# Altium schematic sheet Motor_Control.SchDoc
size B
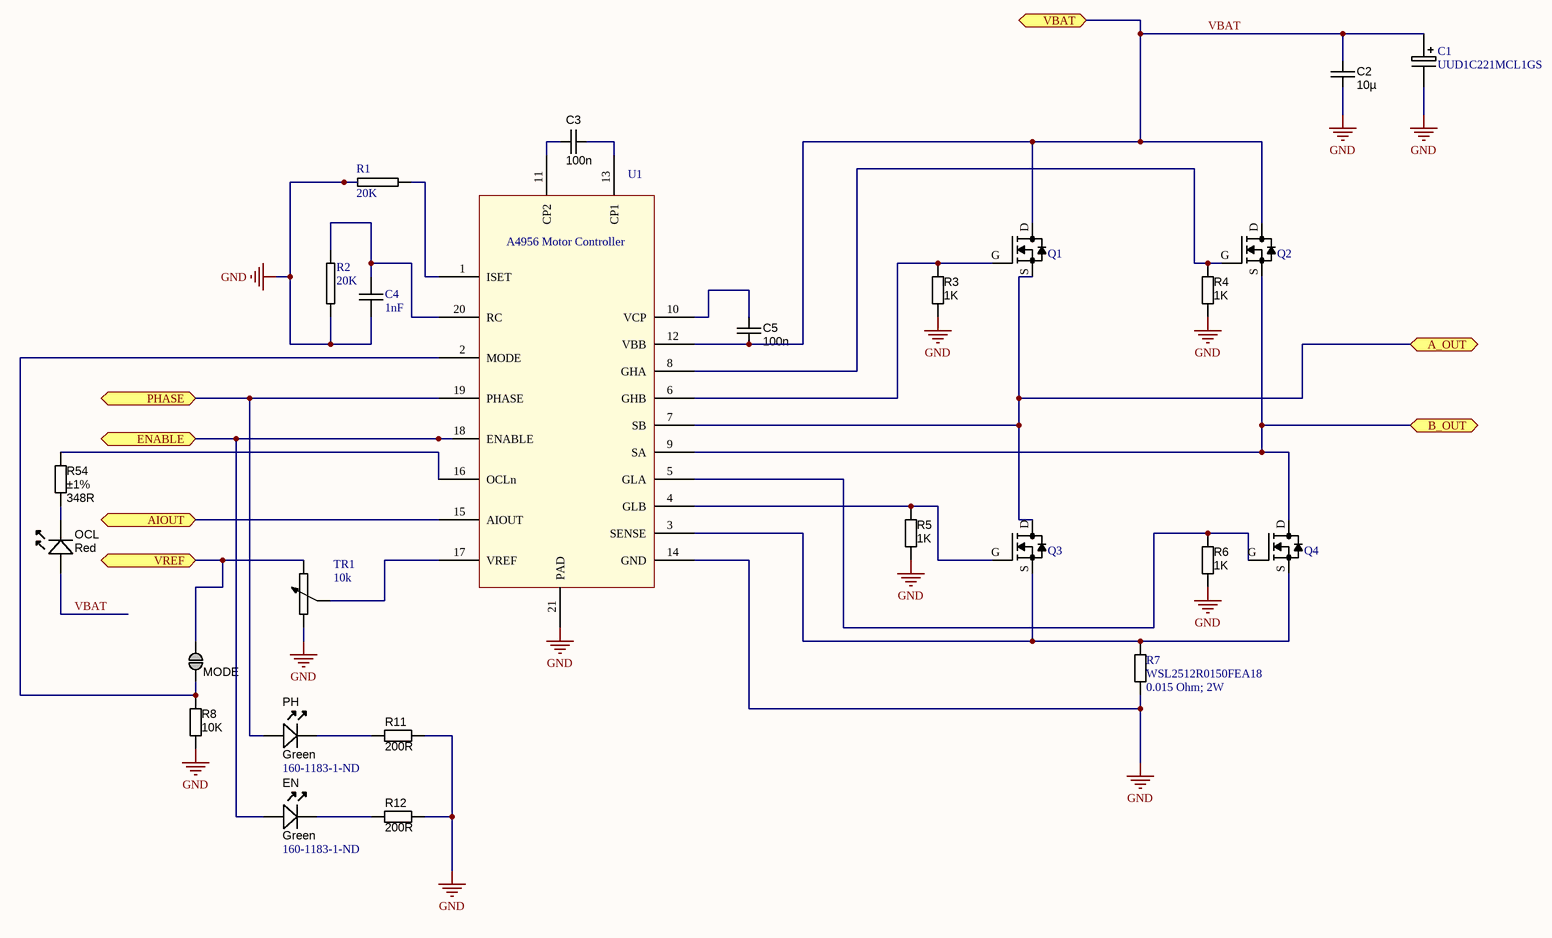
[diagram p0: Motor_Control.SchDoc]

## Parts
C1  UUD1C221MCL1GS  [NICH 6.3mm 7.7mm]
C2  value 10µ  [CAPC2012X135N]  (hidden comment: approved sub OK)
C3  value 100n  [CAPC1608X90N]  (hidden comment: approved sub OK)
C4  1nF  [0603C-GENERIC]
C5  value 100n  [CAPC1608X90N]  (hidden comment: approved sub OK)
EN  Green  Supplier Part Number 1: 160-1183-1-ND  [LED-0603-GREEN]
MODE  Jumper  [JUMP1]  (value not drawn)  (no BOM)
OCL  Red  [LED-0603-RED]
PH  Green  Supplier Part Number 1: 160-1183-1-ND  [LED-0603-GREEN]
Q1  SIS406DN  [1212-8 PowerPAK Single]  (value not drawn)
Q2  SIS406DN  [1212-8 PowerPAK Single]  (value not drawn)
Q3  SIS406DN  [1212-8 PowerPAK Single]  (value not drawn)
Q4  SIS406DN  [1212-8 PowerPAK Single]  (value not drawn)
R1  20K  [0603R-GENERIC]
R2  20K  [0603R-GENERIC]
R3  value 1K  [RESC1608X55N]  (hidden comment: Thick Film)
R4  value 1K  [RESC1608X55N]  (hidden comment: Thick Film)
R5  value 1K  [RESC1608X55N]  (hidden comment: Thick Film)
R6  value 1K  [RESC1608X55N]  (hidden comment: Thick Film)
R7  WSL2512R0150FEA18  Rating: 0.015 Ohm; 2W  [RESC_2512]
R8  value 10K  [RESC1608X55N]  (hidden comment: Thick Film)
R11  value 200R  [RESC1608X55N]  (hidden comment: Thick Film)
R12  value 200R  [RESC1608X55N]  (hidden comment: Thick Film)
R54  value 348R  Tolerance: ±1%  [RESC1608X55N]  (hidden comment: Thin Film)
TR1  10k  [TRIM3224]
U1  A4956  [QFN-20 - 8mil Pad Spacing]  (value not drawn)

## Ports
A_OUT, AIOUT, B_OUT, ENABLE, PHASE, VBAT, VREF

## Nets
GND: C1.- C2.2 C4.2 R1.1 R2.2 R3.2 R4.2 R5.2 R6.2 R7.2 R8.2 R11.2 R12.2 TR1.1 U1.14(GND) U1.21(PAD)
A_OUT: Q1.S Q3.D U1.7(SB) ; port A_OUT
AIOUT: U1.15(AIOUT) ; port AIOUT
B_OUT: Q2.S Q4.D U1.9(SA) ; port B_OUT
ENABLE: EN.A U1.18(ENABLE) ; port ENABLE
PHASE: PH.A U1.19(PHASE) ; port PHASE
VBAT: C1.+ C2.1 C5.2 OCL.A Q1.D Q2.D U1.12(VBB) ; port VBAT
VREF: MODE.2 TR1.2 ; port VREF
NetC3_1: C3.1 U1.11(CP2)
NetC3_2: C3.2 U1.13(CP1)
NetC4_1: C4.1 R2.1 U1.20(RC)
NetC5_1: C5.1 U1.10(VCP)
NetEN_K: EN.K R12.1
NetMODE_1: MODE.1 R8.1 U1.2(MODE)
NetOCL_K: OCL.K R54.2
NetPH_K: PH.K R11.1
NetQ1_G: Q1.G R3.1 U1.6(GHB)
NetQ2_G: Q2.G R4.1 U1.8(GHA)
NetQ3_G: Q3.G R5.1 U1.4(GLB)
NetQ3_S: Q3.S Q4.S R7.1 U1.3(SENSE)
NetQ4_G: Q4.G R6.1 U1.5(GLA)
NetR1_2: R1.2 U1.1(ISET)
NetR54_1: R54.1 U1.16(OCLn)
NetTR1_W: TR1.W U1.17(VREF)

## Notes on the sheet
- (in symbol Motor_CTRL_IC_A4956) A4956 Motor Controller

## Library data of the parts
C1 = NICHICON_220uF_16V: GENERIC CAPACITOR POLARISED; Supplier 1: Digi-Key; Supplier Part Number 1: 493-2264-1-ND
C2 = CAPC_10u_0805_16V: Capacitor SMD Cer 10uF 10% 16V X7R 0805; Ratings: 16V; X7R; Material: ceramic; SCDType: undef; Package / Case: 0805 (2012 metric); Tolerance: ±10%; Supplier 1: Digi-Key; Supplier Part Number 1: 709-1229-1-ND
C3 C5 = CAPC_100n_0603_X7R_50V_10%: Capacitor SMD Cer 100nF 10% 50V X7R 0603; Ratings: 50V; X7R; Material: ceramic; SCDType: spec; Package / Case: 0603 (1608 Metric); Tolerance: ±10%; ComponentLink1URL: http://www.avx.com/docs/Catalogs/cx7r.pdf; ComponentLink1Description: http://www.avx.com/docs/Catalogs/cx7r.pdf; ComponentLink2URL: http://product.tdk.com/capacitor/mlcc/en/documents/mlcc_commercial_general_en.pdf; ComponentLink2Description: http://product.tdk.com/capacitor/mlcc/en/documents/mlcc_commercial_general_en.pdf; Supplier 1: Digi-Key; Supplier Part Number 1: 709-1161-1-ND
C4 = 0603C-1NF-50V-X7R: CAPACITOR 0603 CERAMIC; Supplier 1: Digi-Key; Supplier Part Number 1: 709-1151-1-ND
EN PH = LED_SMD_Green_0603_525nm_350mcd: LED 0603 SMD Green 525nm 350mcd 20mA; Ratings: 200mcd min; 350 mcd typ @ 20mA; Voltage - Forward (Vf) @ 10mA: 3.1V; Viewing Angle: 120°; Lens Style/Size: Rectangle with Flat Top, 1.2mm x 0.8mm; Voltage - Forward (Vf) @ 20mA: 3.3V; SCDType: source; Package / Case: 0603 (1608 metric); Material: InGaN; Color: Green; Current - Test: 20mA; ComponentLink1URL: http://www.mouser.com/ds/2/216/APT1608ZGCK-262051.pdf; ComponentLink1Description: http://www.mouser.com/ds/2/216/APT1608ZGCK-262051.pdf; ComponentLink2Description: APT1608-WAP24 Datasheet; ComponentLink2URL: \\SVFI2\PBLShare\Eng\Electrical Engineering\Hardware\Altium\Libraries and Templates\Unreleased Components\Part Number Request 2013-10-02\APT1608-WAP24(Ver.1B).pdf; Supplier 1: Digi-Key
MODE = JUMP1: SMD jumper
OCL = LED_SMD_Red_0603_220mcd: LED 0603 SMD Hyper Red 630nm 220mcd 20mA; Manufacturer 1: Kingbright Company LLC; Manufacturer Part Number 1: APT1608SURCK; Ratings: 220 mcd; 630 nm; Voltage - Forward (Vf) Typ: 1.95V; Voltage - Forward (Vf) @ 10mA: 1.9V; SCDType: source; Package / Case: 0603 (1608 metric); Material: AlGaInP on GaAs; Supplier 1: Digi-Key; Supplier Part Number 1: 754-1123-1-ND; ComponentLink1URL: http://www.us.kingbright.com/images/catalog/SPEC/APT1608SURCK.pdf; ComponentLink1Description: http://www.us.kingbright.com/images/catalog/SPEC/APT1608SURCK.pdf
Q1-Q4 = MOSFET_N_CHAN_SIS406DN: Supplier 1: Digi-Key; Supplier Part Number 1: SIS406DN-T1-GE3CT-ND
R1 R2 = 0603R-20K: GENERIC RESISTOR 0603; Manufacturer: Stackpole Electronics Inc; Manufacturer Part Number: RNCF 16 T2 20K .1% R; Category: Resistors; Supplier Part Number: RNCF16T220KBRCT-ND; Supplier: Digi-Key; Supplier 1: Digi-Key; Supplier Part Number 1: 311-20.0KHRCT-ND
R3-R6 = RES_1K_0603_5%: Resistor SMD chip 1k Ohm 0.1W 5% 0603; Manufacturer 1: Yageo; Manufacturer Part Number 1: RC0603JR-071KL; Ratings: 1/10 W; SCDType: spec; Package / Case: 0603 (1608 metric); Tolerance: ±5%; Material: Thick Film; Supplier 1: Digi-Key; Supplier Part Number 1: 311-1.0KGRCT-ND; Supplier 2: Digi-Key; Supplier Part Number 2: 541-1.0KGCT-ND; Manufacturer 2: Vishay Dale; Manufacturer Part Number 2: CRCW06031K00JNEA; ComponentLink2URL: http://www.vishay.com/doc?20008; ComponentLink2Description: http://www.vishay.com/doc?20008; ComponentLink1URL: http://www.yageo.com/documents/recent/PYu-RC0603_51_RoHS_L_4.pdf; ComponentLink1Description: http://www.yageo.com/documents/recent/PYu-RC0603_51_RoHS_L_4.pdf
R7 = RES_0.015: RES SMD 0.015 OHM 1% 2W 2512; Supplier 1: Digi-Key; Supplier Part Number 1: WSLH-.015CT-ND
R8 = RES_10K_0603_5%: Resistor SMD chip 10k Ohm 0.1W 5% 0603; Manufacturer 1: Yageo; Manufacturer Part Number 1: RC0603JR-0710KL; Ratings: 1/10 W; SCDType: spec; Package / Case: 0603 (1608 metric); Tolerance: ±5%; Material: Thick Film; Supplier 1: Digi-Key; Supplier Part Number 1: 311-10KGRCT-ND; Supplier 2: Digi-Key; Supplier Part Number 2: 541-10KGCT-ND; Manufacturer 2: Vishay Dale; Manufacturer Part Number 2: CRCW060310K0JNEA; ComponentLink2URL: http://www.vishay.com/doc?20035; ComponentLink2Description: http://www.vishay.com/doc?20035; ComponentLink1URL: http://www.yageo.com/documents/recent/PYu-RC0603_51_RoHS_L_4.pdf; ComponentLink1Description: http://www.yageo.com/documents/recent/PYu-RC0603_51_RoHS_L_4.pdf
R11 R12 = RES_200R_0603_5%: Resistor SMD chip 200 Ohm 0.1W 5% 0603; Manufacturer 1: Yageo; Manufacturer Part Number 1: RC0603JR-07200RL; Ratings: 1/10 W; SCDType: undef; Package / Case: 0603 (1608 metric); Tolerance: ±5%; Material: Thick Film; Supplier 1: Digi-Key; Supplier Part Number 1: 311-200GRCT-ND
R54 = RES_348R_0603_1%: Resistor SMD chip 348 Ohm 0.1W 1% 0603; Manufacturer 1: Yageo; Manufacturer Part Number 1: RC0603FR-07348RL; Ratings: 1/10 W; SCDType: spec; Package / Case: 0603 (1608 metric); Material: Thin Film; Supplier 1: Digi-Key; Supplier Part Number 1: 311-348HRCT-ND
TR1 = R-TRIM-SMD-10k: GENERIC SMD TRIMMER; Manufacturer Part Number: 3224X-1-103E; Manufacturer: Bourns Inc.; Tolerance: ±10%; Power (Watts): 0.25W, 1/4W; Adjustment Type: Top Adjustment; Resistive Material: Cermet; Resistance In Ohms: 10.0K; Temperature Coefficient: ±100ppm/°C; Number of Turns: 11; Supplier 1: Digi-Key; Supplier Part Number 1: 3214X-1-103EDKR-ND; Supplier: Digi-Key; Category: Potentiometers, Variable Resistors; Supplier Part Number: 3224X-1-103ETR-ND; Package / Case: Square - 0.190" L x 0.139" W x 0.200" H (4.80mm x 3.50mm x 5.10mm); Mounting Type: Surface Mount; RoHS: RoHS Compliant; Taper: -; Packaging: Tape & Reel (TR)
U1 = Motor_CTRL_IC_A4956: PWM Motor Controller; Supplier 1: Digi-Key; Supplier Part Number 1: 620-1772-1-ND